# EasyEDA schematic SCH_Jafar_wiredopposite_2022-12-09.json
TITLE: Jafar; REV: 1.1; Date: 2022-12-09; Sheet: 1/1; Drawn By: Jack; Company: Wired Opposite
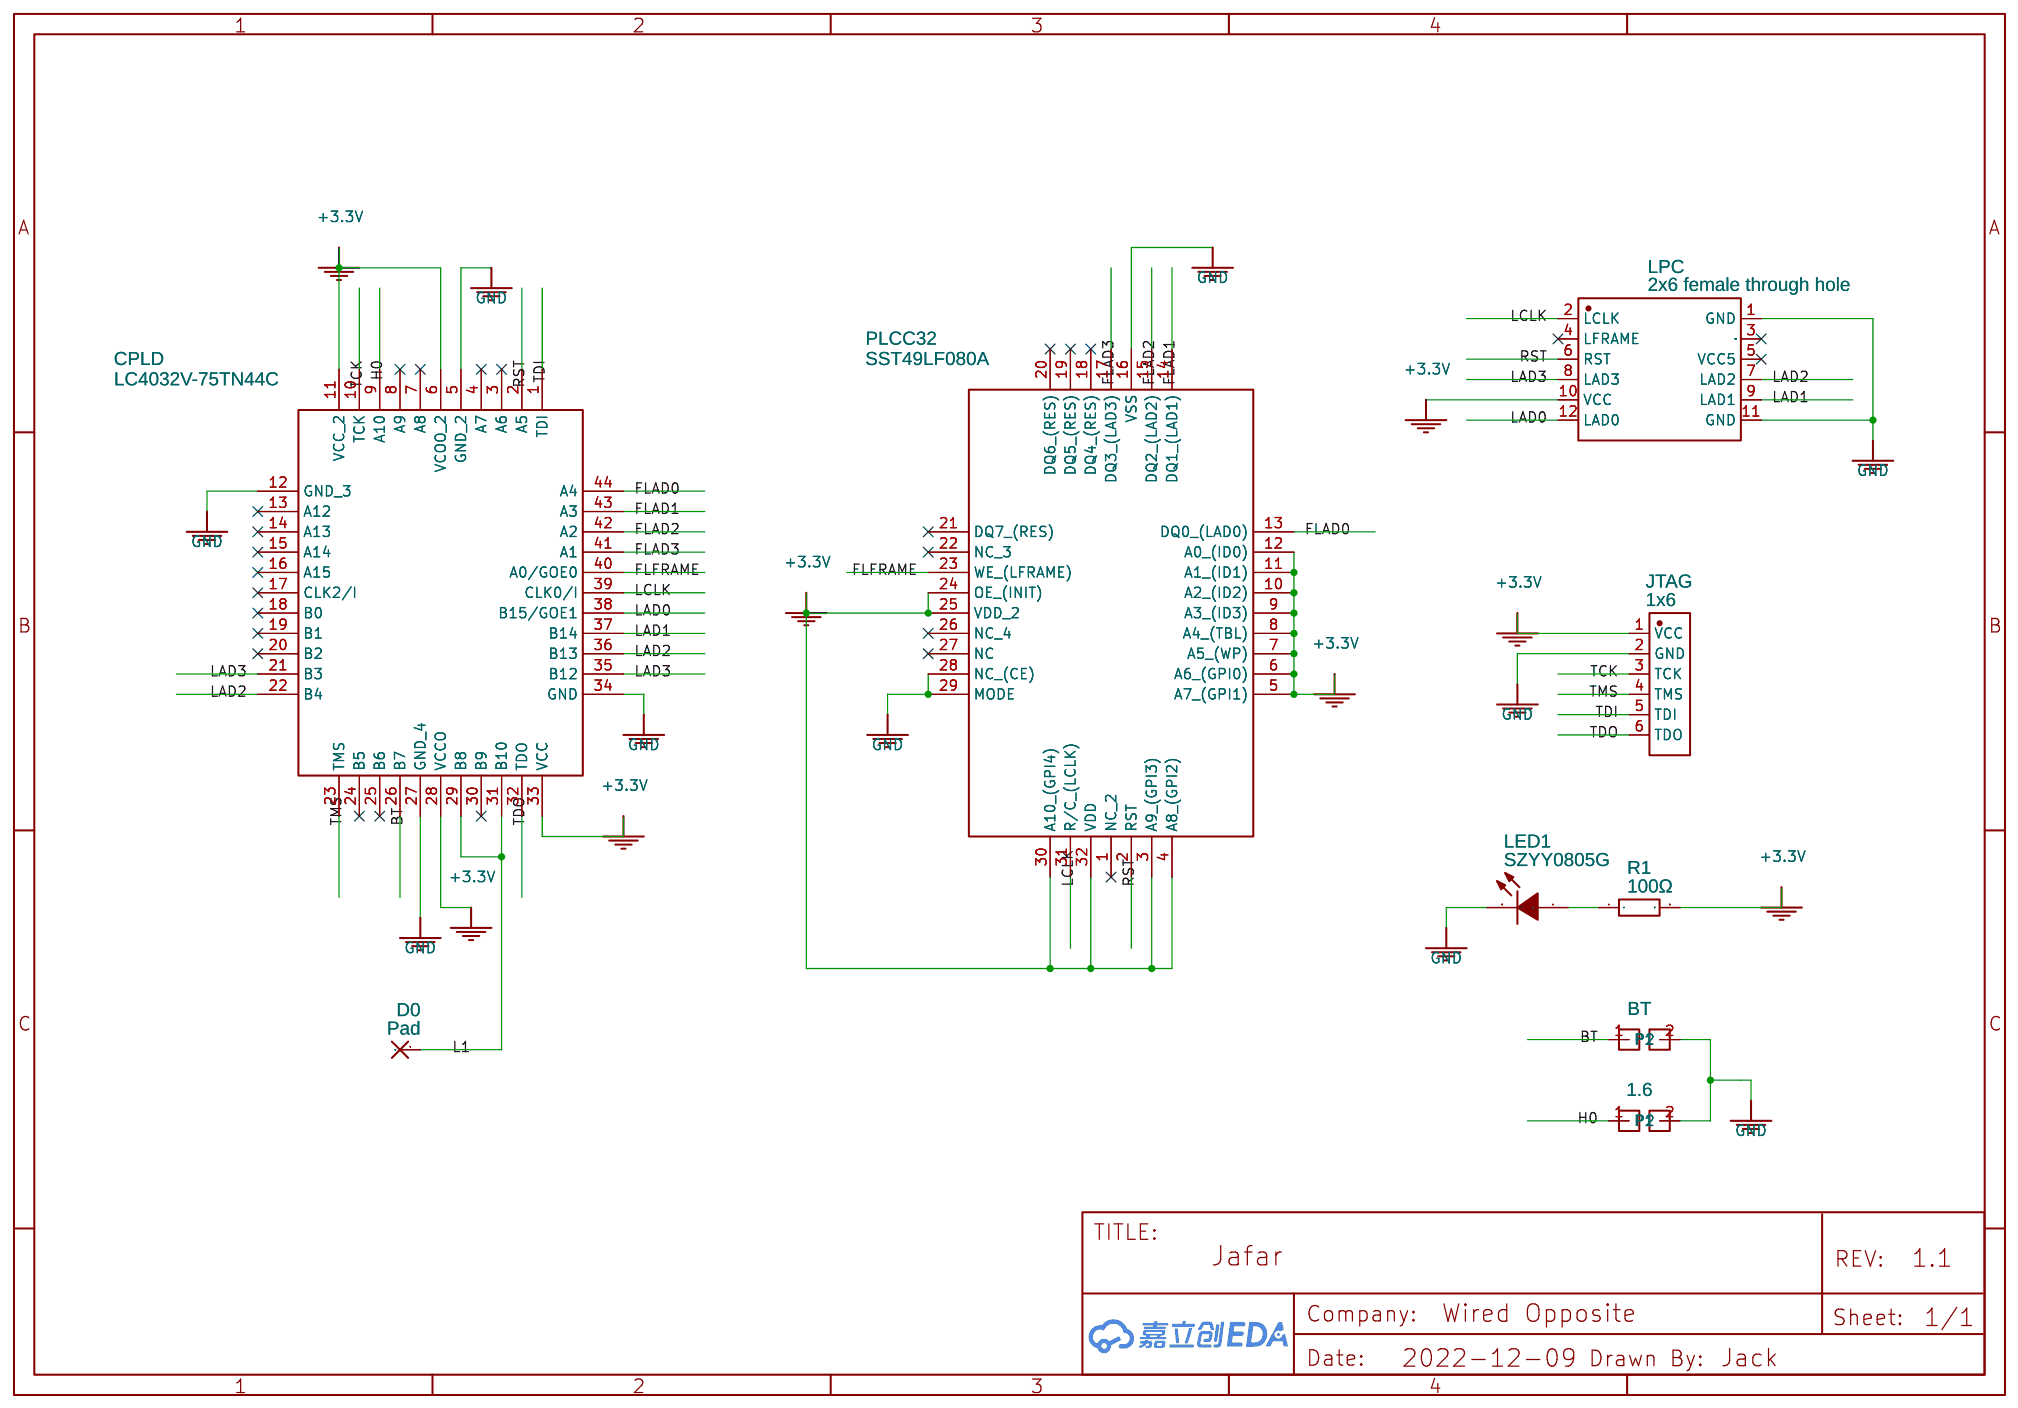
[diagram p0: schematic sheet]

## Parts
1.6  2 PAD WIRE BRIDGE  [2 PAD WIRE BRIDGE]
BT  2 PAD WIRE BRIDGE  [2 PAD WIRE BRIDGE]
CPLD  LC4032V-75TN44C  [TQFP-44_L10.0-W10.0-P0.80-TR]
D0  Pad  [60X140MIL_PAD]
JTAG  1x6  [HDR-TH_6P-P2.54-V-M]
LED1  SZYY0805G  [LED0805-R-RD_2]
LPC  2x6 female through hole  [HDR-TH_12P-P2.54-V-F-R2-C6-S2.54]
PLCC32  SST49LF080A  [DS1032-32SSKT1LR]
R1  100Ω  [R0805]

## Library data of the parts
1.6 BT = 2 PAD WIRE BRIDGE: Contributor: softmachine
CPLD = LC4032V-75TN44C: Manufacturer: Lattice Semiconductor Corporation; link: https://www.digikey.com/en/products/detail/lattice-semiconductor-corporation/LC4032V-75TN44C/2641835?utm_adgroup=Semiconductor%20Modules&utm_source=google&utm_medium=cpc&utm_campaign=Dynamic%20Search_EN_RLSA_Buyers&utm_term=&utm_content=Semiconductor%20Modules&gclid=CjwKCAiAyfybBhBKEiwAgtB7fooJNWJpY8zQlIIkP0ZejRnIVpFw5d4Q2q5Ej_sgAj6nMaq-zbfhZRoCTPMQAvD_BwE; Contributor: softmachine
D0 = WIREPADSMD5-1,8: Contributor: emilio sanchis
JTAG = HB3106F: Supplier: LCSC; Supplier Part: C2761399; Manufacturer: FOXCONN(富士康); Contributor: LCSC; JLCPCB Part Class: Extended Part
LED1 = SZYY0805G: Supplier: LCSC; Supplier Part: C434432; Manufacturer: Yongyu Photoelectric; Contributor: LCSC; JLCPCB Part Class: Extended Part
LPC = 2x6 lpc: Manufacturer: DW254R-22-12-85; Contributor: softmachine
PLCC32 = SST49LF080A: Manufacturer: Microchip Technology; Manufacturer Part: SST49LF080A-33-4C-NHE; Contributor: softmachine
R1 = ERA6AEB101V: Supplier: LCSC; Supplier Part: C445646; Manufacturer: PANASONIC; Resistance (Ohms): 100; Contributor: LCSC; JLCPCB Part Class: Extended Part

## Nets
+3.3V: CPLD.6(VCOO_2) CPLD.11(VCC_2) CPLD.28(VCCO) CPLD.33(VCC) JTAG.1(VCC) LPC.10(VCC) PLCC32.3(A9_(GPI3)) PLCC32.4(A8_(GPI2)) PLCC32.5(A7_(GPI1)) PLCC32.6(A6_(GPI0)) PLCC32.7(A5_(WP)) PLCC32.8(A4_(TBL)) PLCC32.9(A3_(ID3)) PLCC32.10(A2_(ID2)) PLCC32.11(A1_(ID1)) PLCC32.12(A0_(ID0)) PLCC32.24(OE_(INIT)) PLCC32.25(VDD_2) PLCC32.30(A10_(GPI4)) PLCC32.32(VDD) R1.2
GND: 1.6.2(P2) BT.2(P2) CPLD.5(GND_2) CPLD.12(GND_3) CPLD.27(GND_4) CPLD.34(GND) JTAG.2(GND) LED1.2(-) LPC.1(GND) LPC.11(GND) PLCC32.16(VSS) PLCC32.28(NC_(CE)) PLCC32.29(MODE)
BT: BT.1(P1) CPLD.26(B7)
FLAD0: CPLD.44(A4) PLCC32.13(DQ0_(LAD0))
FLAD1: CPLD.43(A3) PLCC32.14(DQ1_(LAD1))
FLAD2: CPLD.42(A2) PLCC32.15(DQ2_(LAD2))
FLAD3: CPLD.41(A1) PLCC32.17(DQ3_(LAD3))
FLFRAME: CPLD.40(A0/GOE0) PLCC32.23(WE_(LFRAME))
H0: 1.6.1(P1) CPLD.9(A10)
L1: CPLD.29(B8) CPLD.31(B10) D0.1(P)
LAD0: CPLD.38(B15/GOE1) LPC.12(LAD0)
LAD1: CPLD.37(B14) LPC.9(LAD1)
LAD2: CPLD.22(B4) CPLD.36(B13) LPC.7(LAD2)
LAD3: CPLD.21(B3) CPLD.35(B12) LPC.8(LAD3)
LCLK: CPLD.39(CLK0/I) LPC.2(LCLK) PLCC32.31(R/C_(LCLK))
RST: CPLD.2(A5) LPC.6(RST) PLCC32.2(RST)
TCK: CPLD.10(TCK) JTAG.3(TCK)
TDI: CPLD.1(TDI) JTAG.5(TDI)
TDO: CPLD.32(TDO) JTAG.6(TDO)
TMS: CPLD.23(TMS) JTAG.4(TMS)
Net-(LED1-1): LED1.1(+) R1.1

Not connected (* = marked no-connect by the designer): CPLD 3(A6)* 4(A7)* 7(A8)* 8(A9)* 13(A12)* 14(A13)* 15(A14)* 16(A15)* 17(CLK2/I)* 18(B0)* 19(B1)* 20(B2)* 24(B5)* 25(B6)* 30(B9)*; LPC 3(NONE)* 4(LFRAME)* 5(VCC5)*; PLCC32 1(NC_2)* 18(DQ4_(RES))* 19(DQ5_(RES))* 20(DQ6_(RES))* 21(DQ7_(RES))* 22(NC_3)* 26(NC_4)* 27(NC)*
